# EAGLE design microbean (EAGLE 7.5.0)
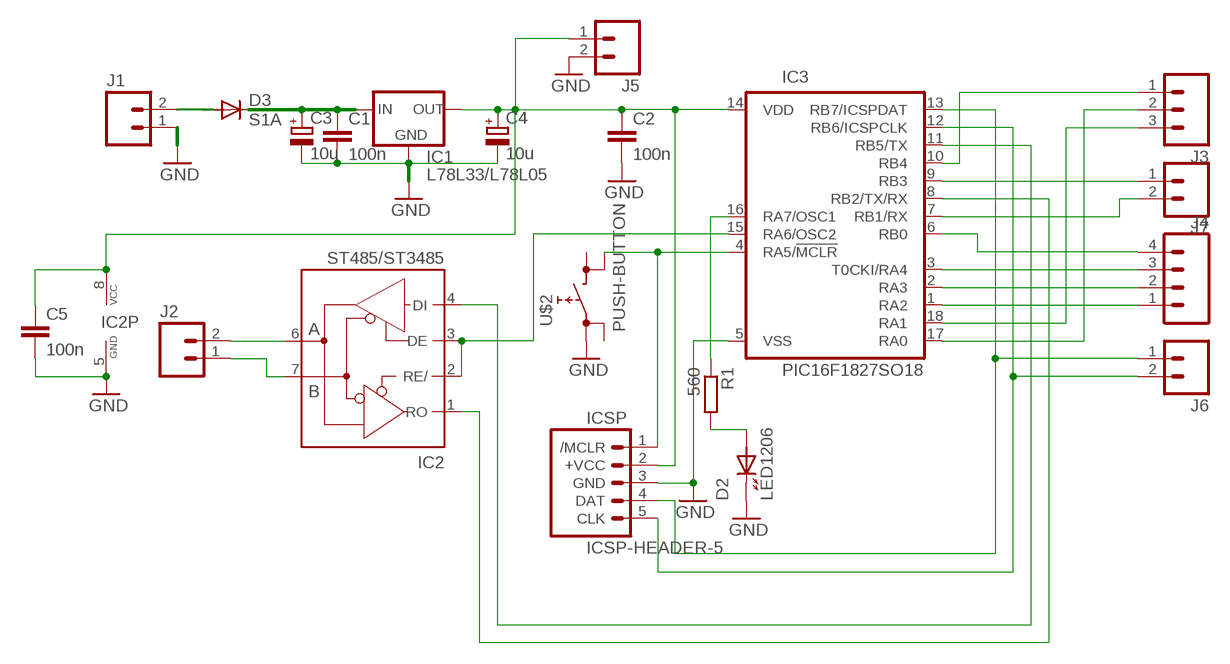
[diagram p0: schematic, sheet 1]

## Parts
C1  100n  C-EUC0805  [C0805]
C2  100n  C-EUC0805  [C0805]
C3  10u  CPOL-EUSMD4X5.3  [UD-4X5,8_NICHICON]
C4  10u  CPOL-EUSMD4X5.3  [UD-4X5,8_NICHICON]
C5  100n  C-EUC0805  [C0805]
D2  LED1206  [CHIPLED_1206]
D3  S1A  S1M  [SMA]
IC1  L78L33/L78L05  78LXXSOT89  [SOT89]
IC2  ST485/ST3485  MAX485ST3485  [SO08]
IC3  PIC16F1827SO18  [SO18W]
ICSP  ICSP-HEADER-5  [1X05]
J1  M02-SCREW-3.5MM3.5MM  [SCREWTERMINAL-3.5MM-2]
J2  M02-SCREW-3.5MM3.5MM  [SCREWTERMINAL-3.5MM-2]
J3  M03  [1X03]
J4  M04  [1X04]
J5  M02  [1X02]
J6  M02  [1X02]
J7  M02  [1X02]
R1  560  R-EU_R0805  [R0805]
U$2  PUSH-BUTTON  [MICRO-SWITCH]

## Nets
A: IC2.6(A) J2.2
B: IC2.7(B) J2.1
GND: C1.2 C2.2 C3.- C4.- C5.2 D2.C(K) IC1.2(GND) IC1.2@1(GND) IC2.5(GND) IC3.5(VSS) ICSP.3(GND) J1.1 J5.2 U$2.1
MCLR: IC3.4(RA5/!MCLR) ICSP.1(/MCLR) U$2.4
N$1 [power]: D3.A J1.2
N$2 [power]: C1.1 C3.+ D3.C IC1.3(IN)
N$10: D2.A R1.2
RA0: IC3.17(RA0) J3.2
RA1: IC3.18(RA1) J3.3
RA2: IC3.1(RA2) J4.1
RA3: IC3.2(RA3) J4.2
RA4: IC3.3(T0CKI/RA4) J4.3
RA6: IC2.2(RE/) IC2.3(DE) IC3.15(RA6/OSC2)
RA7: IC3.16(RA7/OSC1) R1.1
RB0: IC3.6(RB0) J4.4
RB1: IC3.7(RB1/RX) J7.2
RB2: IC2.1(RO) IC3.8(RB2/TX/RX)
RB3: IC3.9(RB3) J7.1
RB4: IC3.10(RB4) J3.1
RB5: IC2.4(DI) IC3.11(RB5/TX)
RB6: IC3.12(RB6/ICSPCLK) ICSP.5(CLK) J6.2
RB7: IC3.13(RB7/ICSPDAT) ICSP.4(DAT) J6.1
VCC: C2.1 C4.+ C5.1 IC1.1(OUT) IC2.8(VCC) IC3.14(VDD) ICSP.2(+VCC) J5.1
Unconnected: U$2.2 U$2.3

## Library data of the parts
C1 C2 C5 = custom:C-EU: CAPACITOR, European symbol
C3 C4 = custom:CPOL-EU: POLARIZED CAPACITOR, European symbol
D2 = custom:LED
D3 = diode:S1M
IC1 = custom:78LXX: VOLTAGE REGULATOR
IC2 = custom:MAX485: RS485 TRANSEIVER
IC3 = custom:PIC16F1827: MICROCONTROLLER
ICSP = custom:ICSP-HEADER-5
J1 J2 = custom:M02-SCREW-3.5MM: Standard 2-pin 0.1" header. Use with - straight break away headers ( PRT-00116) - right angle break away headers (PRT-00553) - swiss pins (PRT-00743) - machine pins (PRT-00117) - female headers (PRT-00115) Molex polarized connector foot print use with: PRT-08233 with associated crimp pins and housings. 2.54_SCREWTERM for use with PRT-10571. 3.5mm Screw Terminal footprints for PRT-08084 5mm Screw Terminal footprints for use with PRT-08432; PROD_ID: CONN-08399
J3 = custom:M03
J4 = custom:M04
J5-J7 = custom:M02
R1 = custom:R-EU_: RESISTOR, European symbol
U$2 = custom:PUSH-BUTTON

## Net classes
1 power: width 0.508 mm

## Board
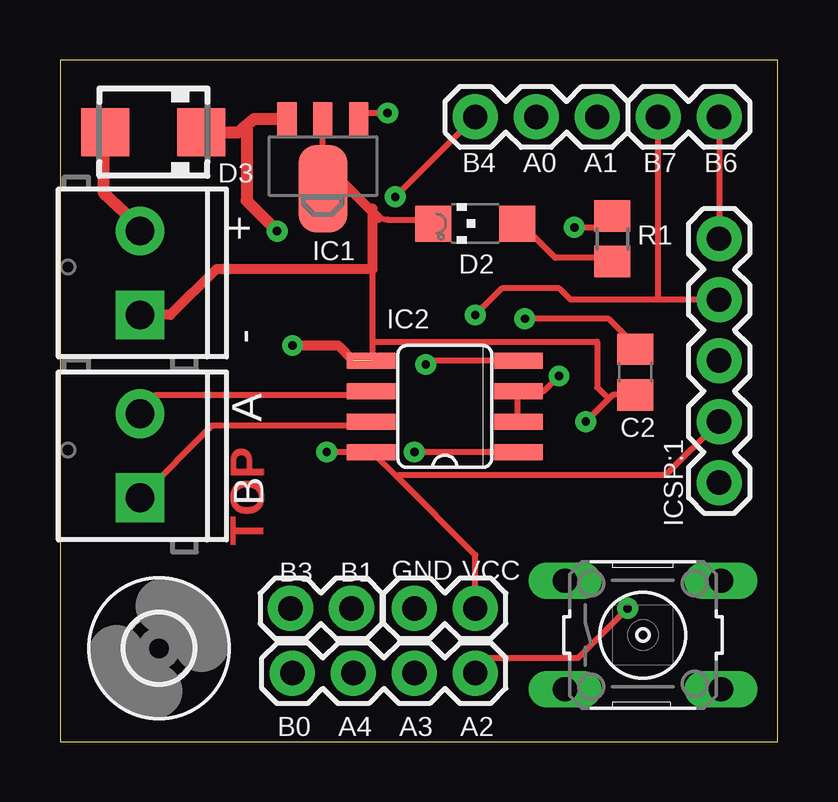
[diagram p1: board, top side]
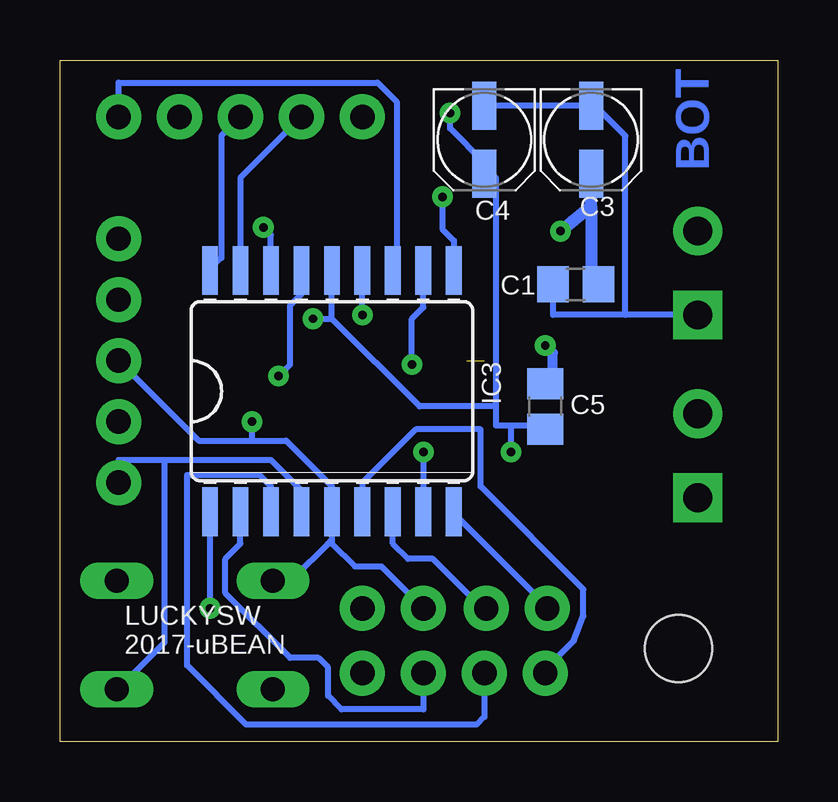
[diagram p2: board, bottom side, seen from below]

Size 29.9 x 28.4 mm. Coordinates in mm from the lower left corner, seen from the top.
Outline: 0,0 29.9,0 29.9,28.4 0,28.4 0,0
Copper layers (1*16): Top 0.018mm / dielectric 1.55mm / Bottom 0.018mm
Design rules "eC_2Layer_PClass3_BaseCopperO105 *": minimum track width 0.25mm, minimum drill 0.45mm, track to track 0.3mm, track to pad 0.3mm, pad to pad 0.3mm, via to via 0.3mm, smd to smd 0mil, copper to edge 0.25mm, drill to drill 0.35mm, minimum pad ring 0.25mm, minimum via ring 0.2mm, stop-mask expansion 0mil, vias tented up to drill 0.45mm, thermal gap 0.2mm

### Footprints (pad centres in the part's own frame; a part is rotated, then mirrored left to right if it is on the bottom)
C0805 = smd 1.3 x 1.5: 1 -0.95,0; 2 0.95,0
UD-4X5,8_NICHICON = smd 2 x 1: + 1.425,0; - -1.425,0
CHIPLED_1206 = smd 1.5 x 1.5: A 0,-1.75; C 0,1.75
SMA = smd 2 x 2: A 2,0; C -2,0
SOT89 = smd 0.8 x 1.4: 1 -1.499,-1.981; 2 0,-1.981; 3 1.499,-1.981 | smd 2.032 x 3.65: 2@1 0,0.94
SO08 = smd 0.66 x 2.032: 1 -1.905,-3.073; 2 -0.635,-3.073; 3 0.635,-3.073; 4 1.905,-3.073; 5 1.905,3.073; 6 0.635,3.073; 7 -0.635,3.073; 8 -1.905,3.073
SO18W = smd 0.66 x 2.032: 1 -5.08,-5.029; 2 -3.81,-5.029; 3 -2.54,-5.029; 4 -1.27,-5.029; 5 0,-5.029; 6 1.27,-5.029; 7 2.54,-5.029; 8 3.81,-5.029; 9 5.08,-5.029; 10 5.08,5.029; 11 3.81,5.029; 12 2.54,5.029; 13 1.27,5.029; 14 0,5.029; 15 -1.27,5.029; 16 -2.54,5.029; 17 -3.81,5.029; 18 -5.08,5.029
1X05 = drill 1.016 pad 1.88: 1 0,0; 2 2.54,0; 3 5.08,0; 4 7.62,0; 5 10.16,0
SCREWTERMINAL-3.5MM-2 = drill 1.2 pad 2.032 square: 1 0,0 | drill 1.2 pad 2.032: 2 3.5,0
1X03 = drill 1.016 pad 1.88: 1 0,0; 2 2.54,0; 3 5.08,0
1X04 = drill 1.016 pad 1.88: 1 0,0; 2 2.54,0; 3 5.08,0; 4 7.62,0
1X02 = drill 1.016 pad 1.88: 1 0,0; 2 2.54,0
R0805 = smd 1.3 x 1.5: 1 -0.95,0; 2 0.95,0
MICRO-SWITCH = drill 1.016 long: 1 -3.251,2.261; 2 3.251,2.261; 3 -3.251,-2.261; 4 3.251,-2.261
2,8 = hole 2.8: 0,0

### Placement (x,y rotation side)
C1  8.41,19.05 180 bottom
C2  23.97,15.4 270 top
C3  7.78,25.08 270 bottom
C4  12.22,25.08 270 bottom
C5  9.68,13.97 90 bottom
D2  17.3,21.59 90 top
D3  3.89,25.4 180 top
IC1  10.95,23.97 180 top
IC2  16.03,13.97 90 top
IC3  18.57,14.61 0 bottom
ICSP  27.46,10.79 90 top
J1  3.33,17.78 90 top
J2  3.33,10.16 90 top
J3  17.3,26.04 0 top
J4  17.3,2.86 180 top
J5  17.3,5.56 180 top
J6  24.92,26.04 0 top
J7  9.6,5.56 0 top
R1  23.02,20.95 270 top
U$2  24.29,4.45 0 top
U$4  [2,8]  4.13,3.89 0 top

### Tracks (layer width: path | path; a pad name or v marks a point on that pad's centre or on a via)
A
  Top 0.25: IC2.6 12.86,14.61 12.7,14.45 3.97,14.45 3.33,13.81 J2.2
B
  Top 0.25: J2.1 6.35,13.18 12.7,13.18 12.86,13.34 IC2.7
GND  (via drill 0.35 pad 0.86)  (1 unrouted)
  Top 0.25: IC1.2 IC1.2@1 11.11,23.97 | D2.C 15.4,21.59 15.24,21.75 13.65,21.75 13.26,21.83 13.02,22.22 | 13.02,19.68 13.02,16.67 | 13.02,16.67 13.02,15.88 IC2.5 | 13.02,16.67 22.38,16.67
  Top 0.254: C2.2 23.02,14.45 22.86,14.29 | 22.86,14.29 v21.91,13.34 | 22.38,16.67 22.38,14.76 22.86,14.29
  Top 0.406: 11.11,23.97 13.26,21.83 | 13.02,22.22 13.02,19.68 6.51,19.68 4.6,17.78 J1.1 | v9.68,16.51 11.59,16.51 12.22,15.88
  Bottom 0.25: C3.- C4.- | 9.37,15.24 C5.2 | C1.2 9.37,17.78 6.35,17.78 | J1.1 6.35,17.78 | 6.35,17.78 6.35,25.24 7.78,26.67 C3.- | C3.- | 18.57,8.41 18.73,8.25 20.16,6.83 20.95,6.83 U$2.1 | 18.57,9.52 18.57,8.25 17.62,7.3 16.51,7.3 J5.2 | IC3.5 18.57,10.64 20.48,12.54 21.91,12.54 24.13,12.54 ICSP.3
  Bottom 0.254: v21.91,13.34 21.91,12.54 | IC3.5 18.57,9.52 | 18.57,8.25 18.73,8.25
  Bottom 0.406: 9.37,15.24 9.37,16.19 v9.68,16.51
MCLR
  Bottom 0.25: IC3.4 19.84,10.48 21.11,11.75 25.56,11.75 | 25.56,11.75 27.46,11.75 ICSP.1 | 25.56,11.75 25.56,4.13 27.46,2.22 U$2.4
N$1
  Top 0.508: D3.A 1.83,25.32 1.83,22.86 3.33,21.43 J1.2
N$2  (via drill 0.35 pad 0.86)
  Top 0.508: 7.62,25.56 7.46,25.4 D3.C | 7.62,25.56 8.1,25.96 IC1.3 | v9.05,21.27 7.78,22.54 7.78,25.56 7.62,25.56
  Bottom 0.508: 7.78,22.3 7.78,19.21 7.62,19.05 C1.1 | v9.05,21.27 7.78,22.3 | 7.78,22.3 C3.+
N$10
  Top 0.25: D2.A 19.21,21.59 20.64,20.16 23.02,20.16 R1.2
RA0
  Bottom 0.25: IC3.17 22.38,23.5 J3.2
RA1
  Bottom 0.25: J3.3 23.18,25.24 23.18,20.16 23.65,19.68 IC3.18
RA2  (via drill 0.35 pad 0.86)
  Top 0.25: v23.65,5.56 21.59,3.49 17.86,3.49 J4.1
  Bottom 0.25: v23.65,5.56 IC3.1
RA3
  Bottom 0.25: J4.2 14.76,1.35 18.18,1.35 18.73,1.9 18.73,3.1 19.13,3.49 20.32,3.49 23.02,6.19 23.02,7.62 22.38,8.25 IC3.2
RA4
  Bottom 0.25: J4.3 12.22,1.03 12.54,0.71 22.15,0.71 24.61,3.18 24.61,11.11 21.59,11.11 21.11,10.64 21.27,10.16 21.11,9.68 IC3.3
RA6  (via drill 0.35 pad 0.86)
  Top 0.25: IC2.2 19.05,13.34 19.05,14.61 IC2.3 20.16,14.61 v20.8,15.24
  Bottom 0.25: v20.8,15.24 20.32,15.72 20.32,18.18 19.84,18.65 IC3.15
RA7  (via drill 0.35 pad 0.86)
  Top 0.25: v21.43,21.43 22.7,21.43 23.02,21.75 R1.1
  Bottom 0.25: v21.43,21.43 21.11,21.11 IC3.16
RB0
  Bottom 0.25: IC3.6 17.3,10.79 15.08,13.02 12.38,13.02 12.38,10.64 8.1,6.35 8.1,5.24 8.25,4.84 8.49,4.21 9.68,3.02 J4.4
RB1
  Bottom 0.25: IC3.7 16.03,8.25 15.4,7.62 14.37,7.62 12.3,5.56 J7.2
RB2  (via drill 0.35 pad 0.86)
  Top 0.25: IC2.1 v14.76,12.07
  Bottom 0.25: v14.76,12.07 IC3.8
RB3
  Bottom 0.25: J7.1 9.68,5.71 13.49,9.52 IC3.9
RB4  (via drill 0.35 pad 0.86)
  Top 0.25: J3.1 v13.97,22.7
  Bottom 0.25: v13.97,22.7 13.97,21.35 13.49,20.88 IC3.10
RB5  (via drill 0.35 pad 0.86)
  Top 0.25: v15.24,15.72 15.4,15.88 IC2.4
  Bottom 0.25: v15.24,15.72 15.24,17.62 14.76,18.1 IC3.11
RB6
  Top 0.25: J6.2 ICSP.5
  Bottom 0.25: J6.2 27.46,27.46 16.67,27.46 15.87,26.67 15.87,19.84 16.03,19.68 IC3.12
RB7  (via drill 0.35 pad 0.86)
  Top 0.25: v17.3,17.78 18.41,18.89 20.8,18.89 21.27,18.41 24.92,18.41 | ICSP.4 24.92,18.41 | 24.92,18.41 J6.1
  Bottom 0.25: v17.3,17.78 IC3.13
VCC  (via drill 0.35 pad 0.86)
  Top 0.25: v13.65,26.19 12.54,26.19 IC1.1 | ICSP.2 25.24,11.11 14.13,11.11 14.05,11.03 | 14.05,11.03 17.3,7.78 J5.1 | 14.05,11.03 13.02,12.07 IC2.8 v11.11,12.07
  Top 0.254: C2.1 23.81,16.67 22.86,17.62 v19.37,17.62
  Bottom 0.25: v13.65,26.19 13.65,25.56 12.22,24.13 C4.+ 12.22,23.97 11.75,23.5 11.75,13.97 | 11.11,13.18 11.75,13.18 11.75,13.97 | 11.11,13.18 9.68,13.18 C5.1 | 11.75,13.97 14.92,13.97 18.57,17.62 IC3.14 | v11.11,12.07 11.11,13.18
  Bottom 0.254: v19.37,17.62 18.57,17.62

### Text on the board
Top: TOP
Bottom: BOT
tNames: B4 | A0 | A1 | B7 | B6 | + | - | A | B | ICSP:1 | B3 | B1 | GND | VCC | B0 | A4 | A3 | A2
bNames: LUCKYSW / 2017-uBEAN